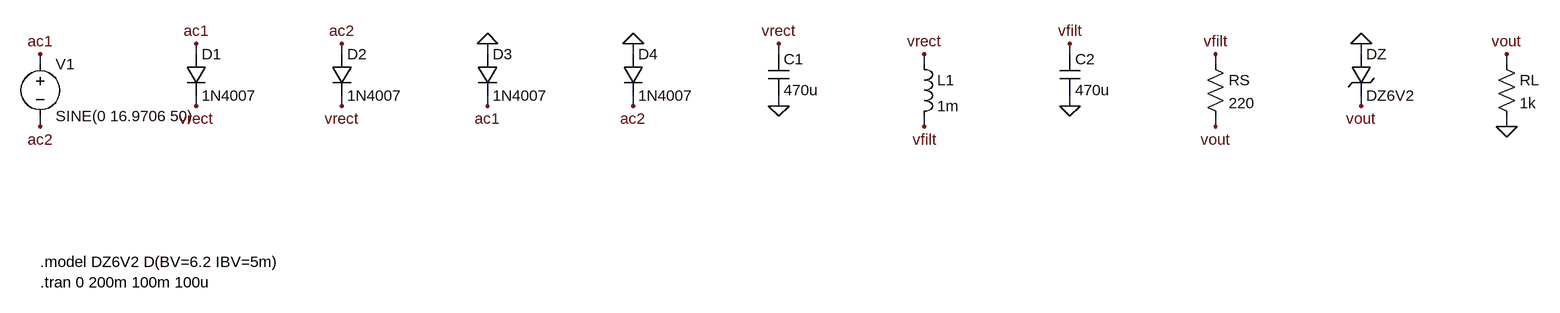
[diagram p0: schematic q3.asc]
q3.asc, the LTspice schematic file:
Version 4.1
SHEET 1 2496 808
SYMBOL voltage 112 160 R0
SYMATTR InstName V1
SYMATTR Value SINE(0 16.9706 50)
SYMBOL diode 336 160 R0
SYMATTR InstName D1
SYMATTR Value 1N4007
SYMBOL diode 560 160 R0
SYMATTR InstName D2
SYMATTR Value 1N4007
SYMBOL diode 784 160 R0
SYMATTR InstName D3
SYMATTR Value 1N4007
SYMBOL diode 1008 160 R0
SYMATTR InstName D4
SYMATTR Value 1N4007
SYMBOL cap 1232 160 R0
SYMATTR InstName C1
SYMATTR Value 470u
SYMBOL ind 1456 160 R0
SYMATTR InstName L1
SYMATTR Value 1m
SYMBOL cap 1680 160 R0
SYMATTR InstName C2
SYMATTR Value 470u
SYMBOL res 1904 160 R0
SYMATTR InstName RS
SYMATTR Value 220
SYMBOL zener 2128 160 R0
SYMATTR InstName DZ
SYMATTR Value DZ6V2
SYMBOL res 2352 160 R0
SYMATTR InstName RL
SYMATTR Value 1k
WIRE 112 176 112 160
WIRE 352 160 352 144
WIRE 800 224 800 240
WIRE 112 256 112 272
WIRE 576 160 576 144
WIRE 1024 224 1024 240
WIRE 352 224 352 240
WIRE 576 224 576 240
WIRE 1248 160 1248 144
WIRE 1472 176 1472 160
WIRE 1472 256 1472 272
WIRE 1696 160 1696 144
WIRE 1920 176 1920 160
WIRE 1920 256 1920 272
WIRE 2144 224 2144 240
WIRE 2368 176 2368 160
WIRE 800 160 800 144
WIRE 1024 160 1024 144
WIRE 1248 224 1248 240
WIRE 1696 224 1696 240
WIRE 2144 160 2144 144
WIRE 2368 256 2368 272
FLAG 112 160 ac1
FLAG 352 144 ac1
FLAG 800 240 ac1
FLAG 112 272 ac2
FLAG 576 144 ac2
FLAG 1024 240 ac2
FLAG 352 240 vrect
FLAG 576 240 vrect
FLAG 1248 144 vrect
FLAG 1472 160 vrect
FLAG 1472 272 vfilt
FLAG 1696 144 vfilt
FLAG 1920 160 vfilt
FLAG 1920 272 vout
FLAG 2144 240 vout
FLAG 2368 160 vout
FLAG 800 144 0
FLAG 1024 144 0
FLAG 1248 240 0
FLAG 1696 240 0
FLAG 2144 144 0
FLAG 2368 272 0
TEXT 112 480 Left 2 !.model DZ6V2 D(BV=6.2 IBV=5m)
TEXT 112 512 Left 2 !.tran 0 200m 100m 100u

The netlist it stands for:
* q3.asc
V1 ac1 ac2 SINE(0 16.9706 50)
D1 ac1 vrect 1N4007
D2 ac2 vrect 1N4007
D3 0 ac1 1N4007
D4 0 ac2 1N4007
C1 vrect 0 470u
L1 vrect vfilt 1m
C2 vfilt 0 470u
RS vfilt vout 220
DZ 0 vout DZ6V2
RL vout 0 1k
.model D D
.lib standard.dio
.model DZ6V2 D(BV=6.2 IBV=5m)
.tran 0 200m 100m 100u
.backanno
.end